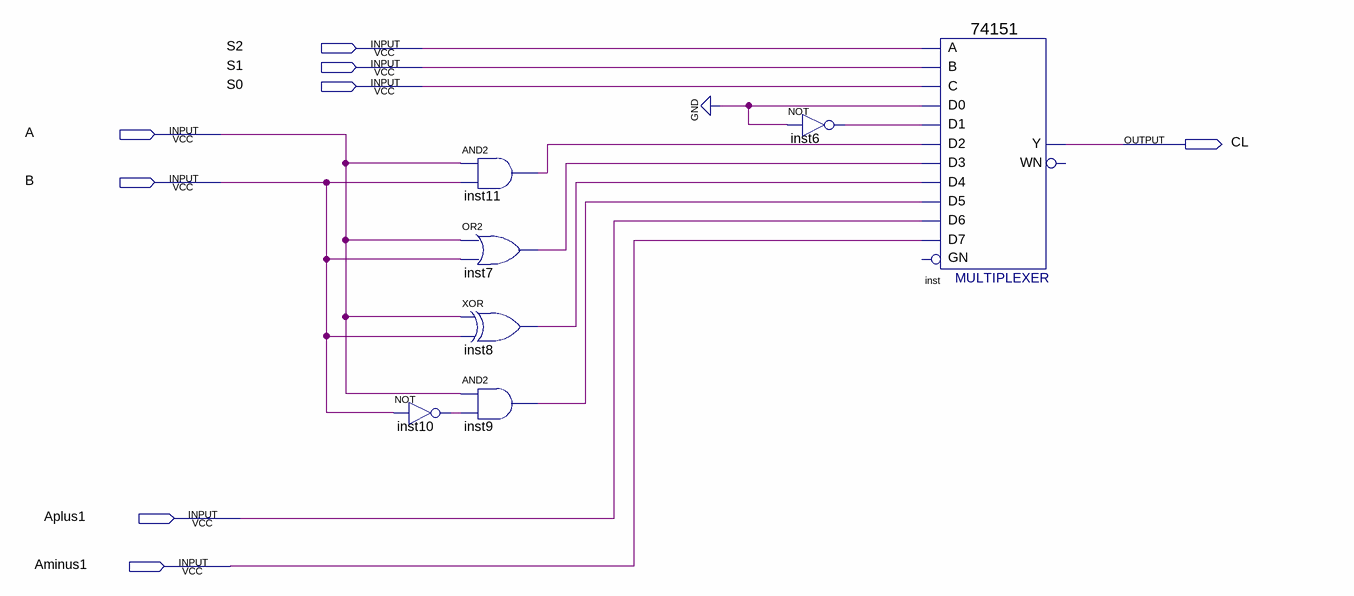
[diagram p0: schematic sheet]
// Quartus schematic logiccircuit1bit.bdf as structural Verilog: 7 symbols, 8 pins
module logiccircuit1bit (
  input  S2,
  input  S1,
  input  S0,
  input  A,
  input  B,
  input  Aplus1,
  input  Aminus1,
  output CL
);

  wire inst6_out, inst7_out, inst8_out, inst9_out, inst10_out, inst11_out;

  not inst10 (inst10_out, B);
  and inst11 (inst11_out, A, B);
  or inst7 (inst7_out, A, B);
  xor inst8 (inst8_out, A, B);
  and inst9 (inst9_out, A, inst10_out);
  not inst6 (inst6_out, 1'b0);
  \74151  inst (
    .C(S0), .B(S1), .A(S2), .D5(inst9_out), .D0(1'b0), .D1(inst6_out), .D4(inst8_out), .D3(inst7_out),
    .D2(inst11_out), .D6(Aplus1), .D7(Aminus1), .Y(CL));  // open: GN, WN
endmodule
